# EAGLE design AudioAmplifier (EAGLE 8.3.2)
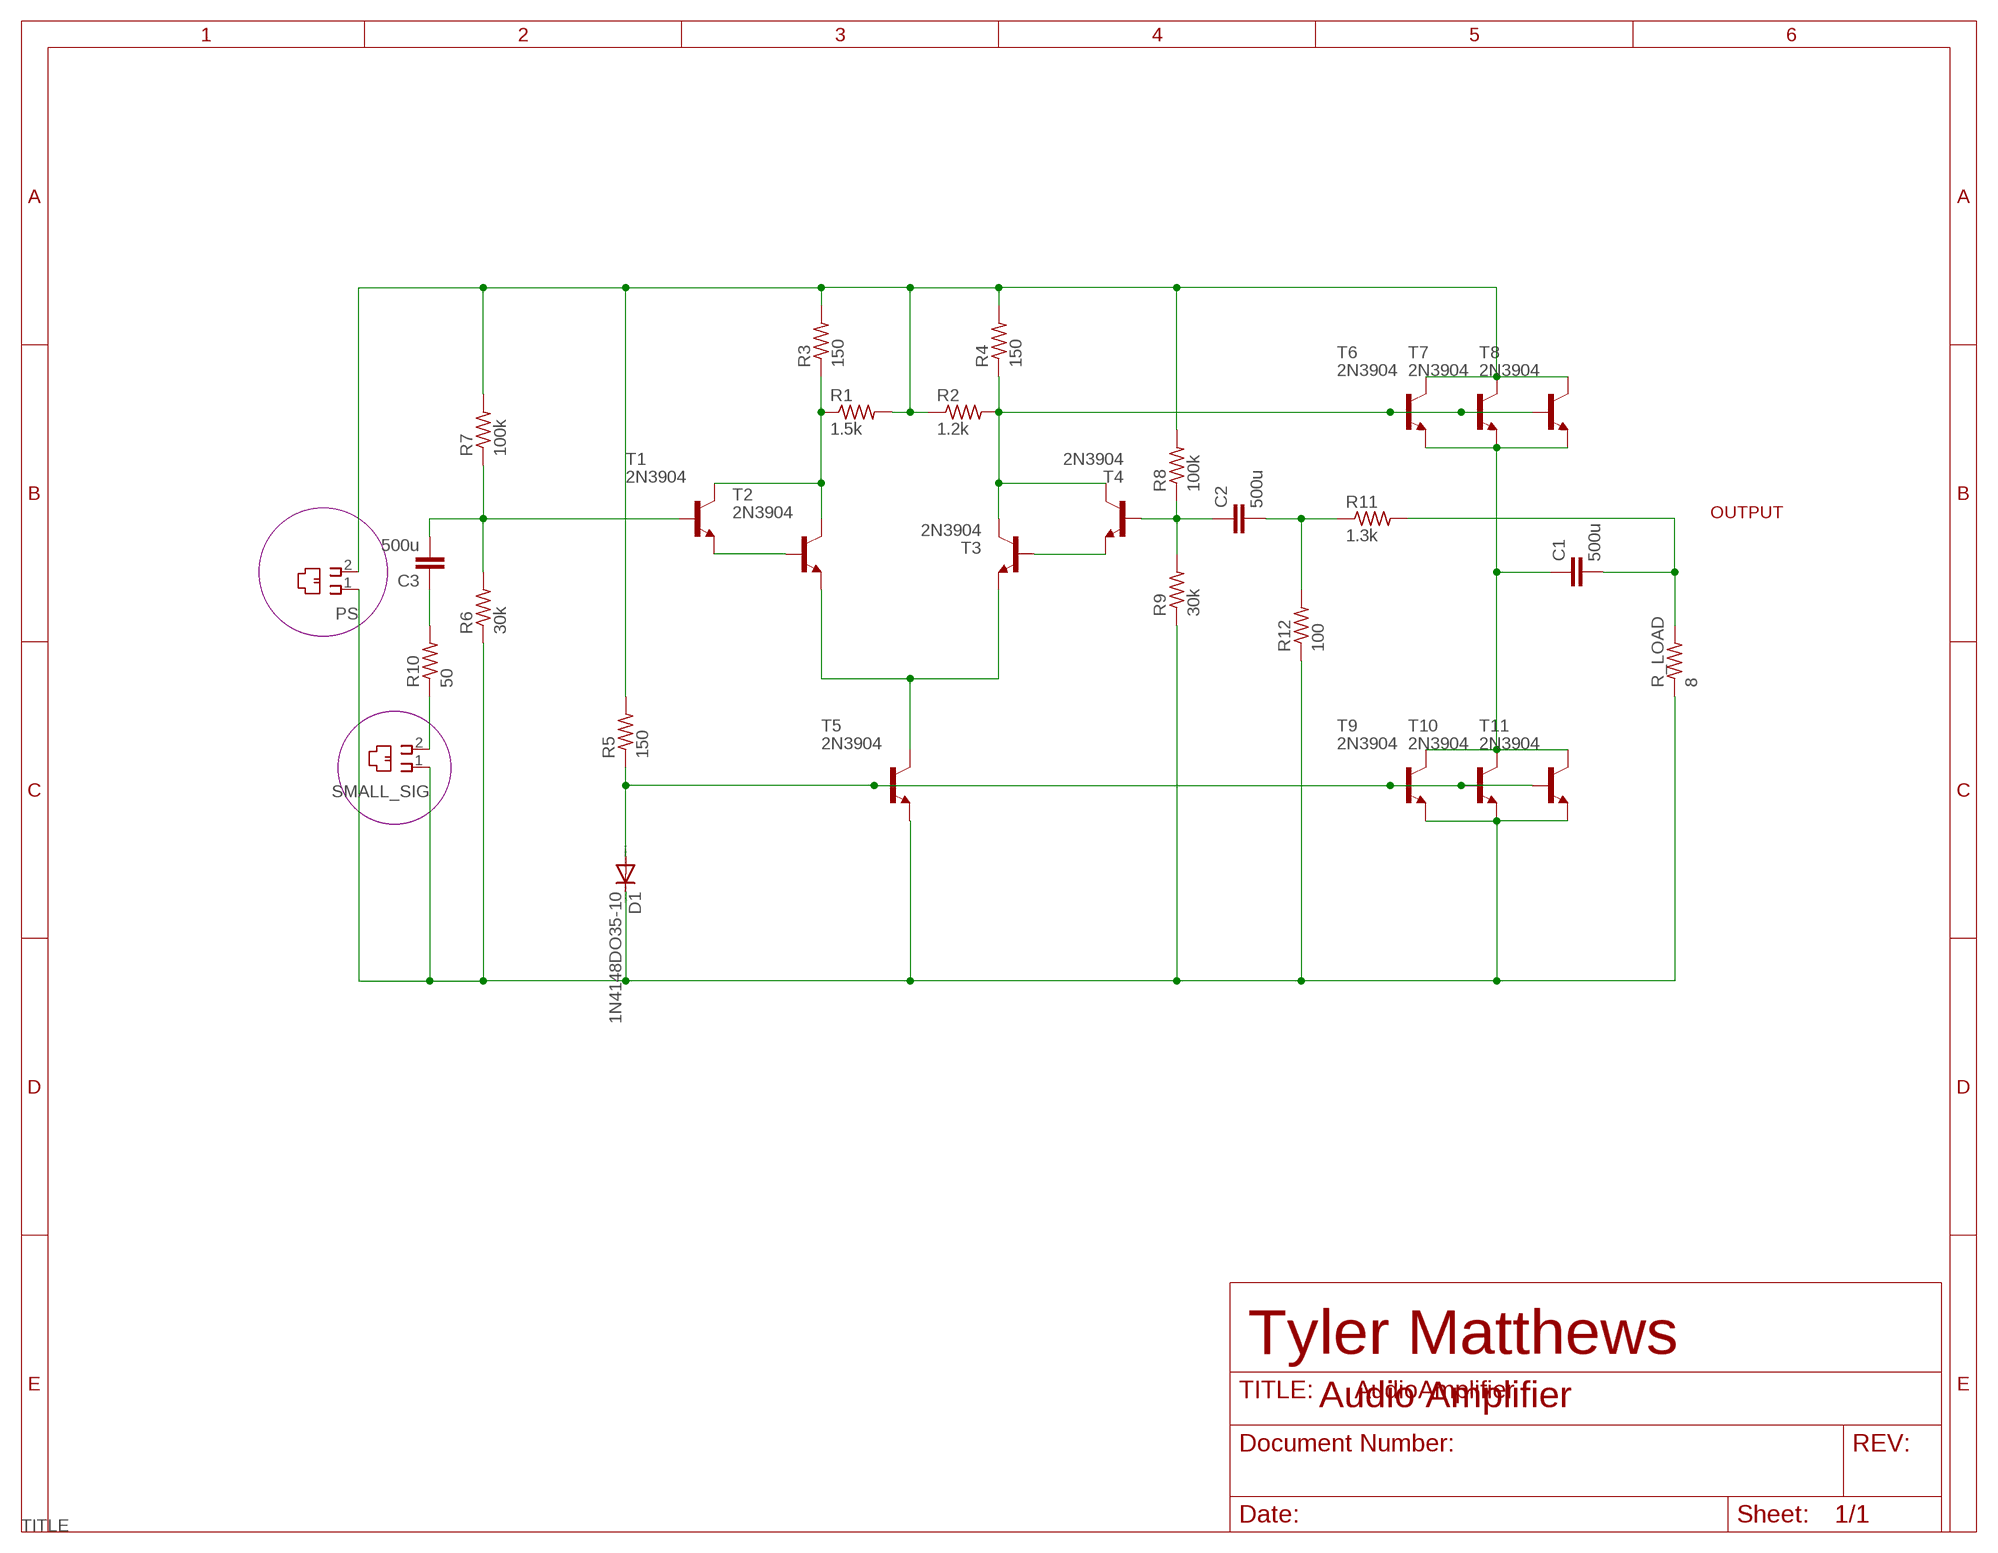
[diagram p0: schematic, sheet 1]
FRAME1 (FRAME_A_L): AUDIO_AMPLIFIER: TITLE

## Parts
C1  500u  C2.5/2  [C2.5-2]
C2  500u  C2.5/2  [C2.5-2]
C3  500u  C2.5/2  [C2.5-2]
D1  1N4148DO35-10  [DO35-10]
PS  215876-7  [215876-7]
R1  1.5k  R-US_0204/2V  [0204V]
R2  1.2k  R-US_0204/2V  [0204V]
R3  150  R-US_0204/2V  [0204V]
R4  150  R-US_0204/2V  [0204V]
R5  150  R-US_0204/2V  [0204V]
R6  30k  R-US_0204/2V  [0204V]
R7  100k  R-US_0204/2V  [0204V]
R8  100k  R-US_0204/2V  [0204V]
R9  30k  R-US_0204/2V  [0204V]
R10  50  R-US_0204/2V  [0204V]
R11  1.3k  R-US_0204/2V  [0204V]
R12  100  R-US_0204/2V  [0204V]
R_LOAD  8  R-US_0204/2V  [0204V]
SMALL_SIG  215876-7  [215876-7]
T1  2N3904  [TO92]
T2  2N3904  [TO92]
T3  2N3904  [TO92]
T4  2N3904  [TO92]
T5  2N3904  [TO92]
T6  2N3904  [TO92]
T7  2N3904  [TO92]
T8  2N3904  [TO92]
T9  2N3904  [TO92]
T10  2N3904  [TO92]
T11  2N3904  [TO92]

## Nets
N$1: T3.2(B) T4.3(E)
N$2: T1.3(E) T2.2(B)
N$3: R1.1 R3.1 T1.1(C) T2.1(C)
N$4: R2.2 R4.1 T3.1(C) T4.1(C) T6.2(B) T7.2(B) T8.2(B)
N$6: T2.3(E) T3.3(E) T5.1(C)
N$7: D1.A R5.1 T5.2(B) T9.2(B) T10.2(B) T11.2(B)
N$8: C3.2 R6.2 R7.1 T1.2(B)
N$9: C1.1 T6.3(E) T7.3(E) T8.3(E) T9.1(C) T10.1(C) T11.1(C)
N$10: R10.1 SMALL_SIG.2
N$11: C2.1 R8.1 R9.2 T4.2(B)
N$12: C3.1 R10.2
N$13: PS.2 R1.2 R2.1 R3.2 R4.2 R5.2 R7.2 R8.2 T6.1(C) T7.1(C) T8.1(C)
N$16: C2.2 R11.1 R12.2
N$17: D1.C PS.1 R6.1 R9.1 R12.1 R_LOAD.1 SMALL_SIG.1 T5.3(E) T9.3(E) T10.3(E) T11.3(E)
OUTPUT: C1.2 R11.2 R_LOAD.2

## Notes on the sheet
- Tyler Matthews
- Audio Amplifier

## Library data of the parts
C1-C3 = capacitor-wima:C: CAPACITOR naming: grid - package width
D1 = diode:1N4148: DIODE high speed (Philips)
PS SMALL_SIG = con-amp:215876-7: AMP connector
R1-R12 R_LOAD = rcl:R-US_: RESISTOR, American symbol
T1-T11 = transistor:2N3904: NPN TRANSISTOR

## Board
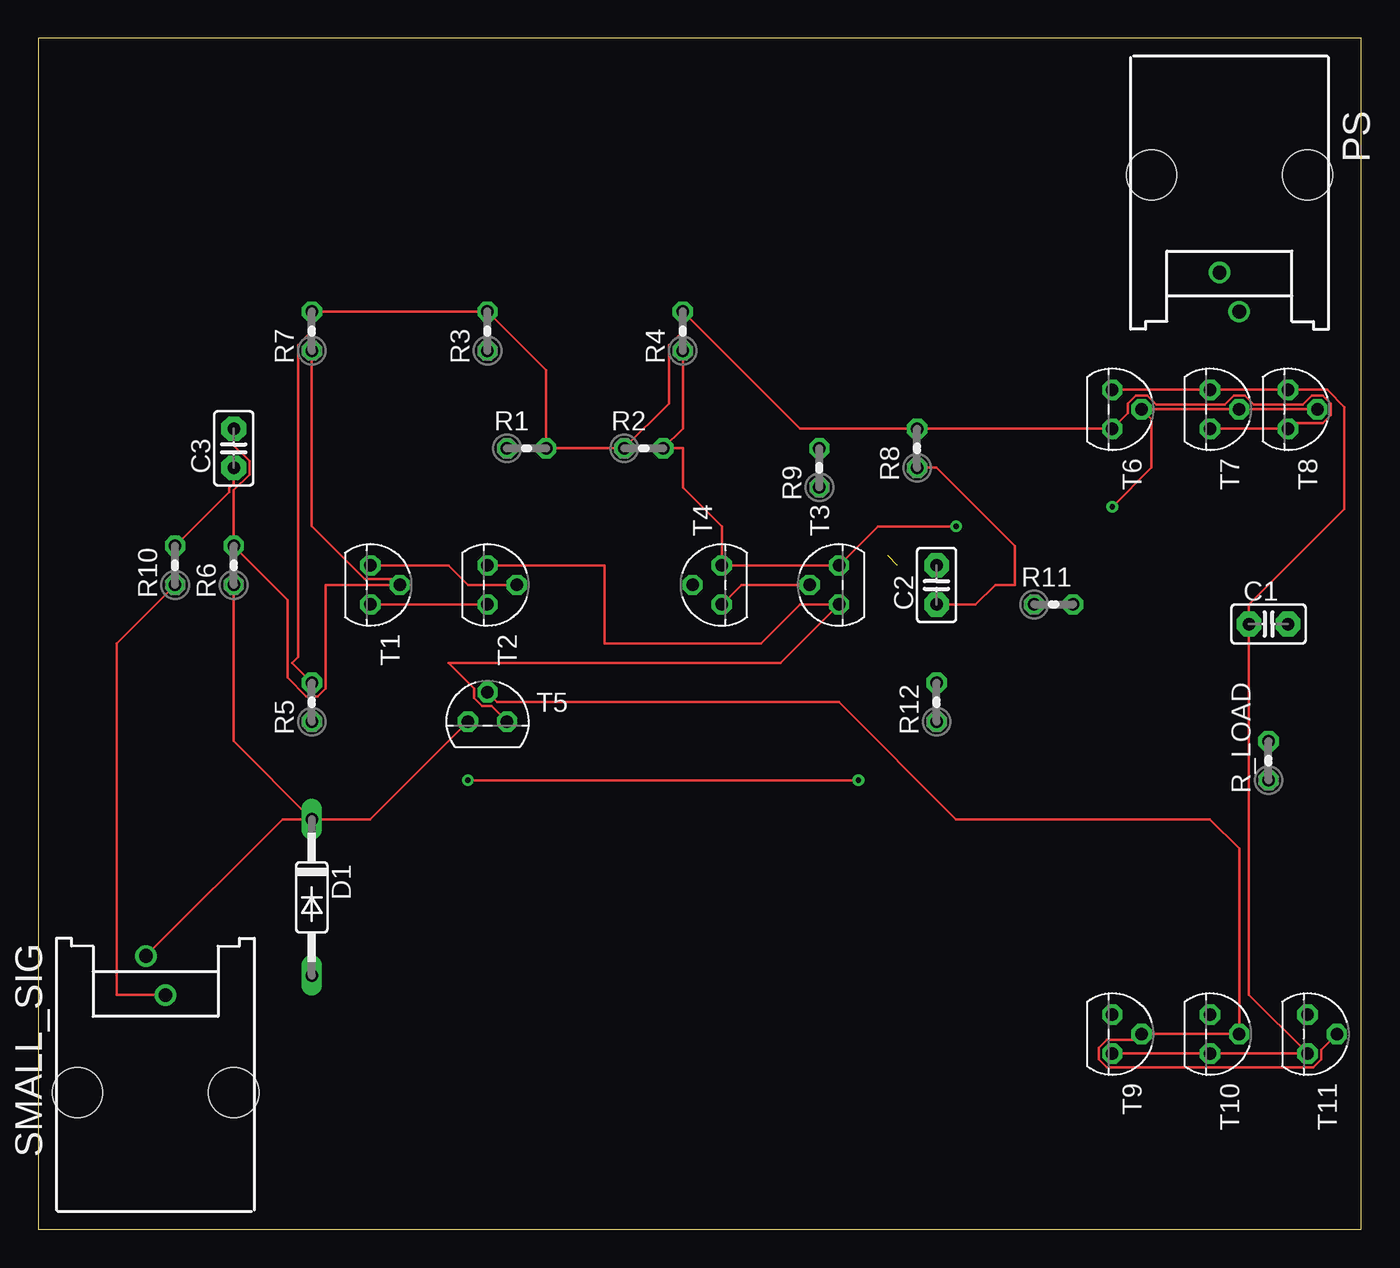
[diagram p1: board, top side]
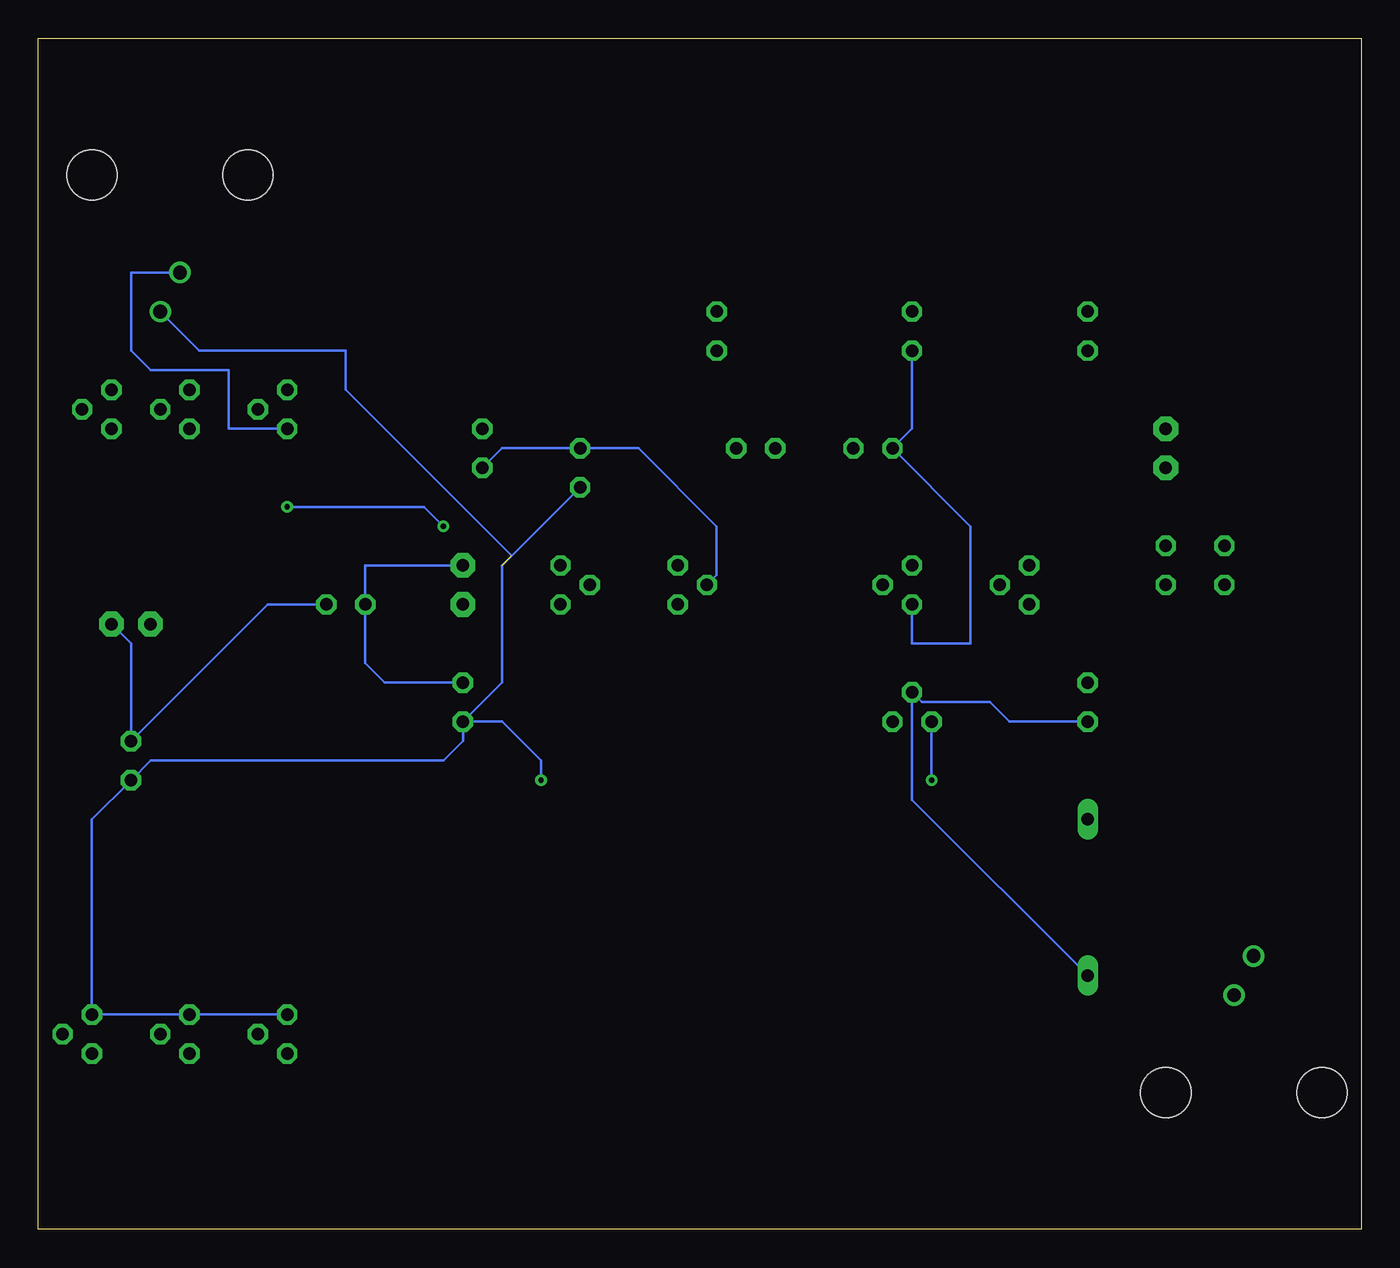
[diagram p2: board, bottom side, seen from below]

Size 86.03 x 77.46 mm. Coordinates in mm from the lower left corner, seen from the top.
Outline: 0,0 86.03,0 86.03,77.46 0,77.46 0,0
Copper layers (1*16): Top 0.035mm / dielectric 1.5mm / Bottom 0.035mm
Design rules "default": minimum track width 6mil, minimum drill 0.35mm, track to track 6mil, track to pad 6mil, pad to pad 6mil, via to via 6mil, smd to smd 6mil, copper to edge 40mil, drill to drill 6mil, minimum pad ring 10mil, minimum via ring 8mil, stop-mask expansion 4mil, vias tented up to drill 0mil, thermal gap 10mil

### Footprints (pad centres in the part's own frame; a part is rotated, then mirrored left to right if it is on the bottom)
C2.5-2 = drill 0.813 pad 1.6 octagon: 1 -1.27,0; 2 1.27,0
DO35-10 = drill 0.813 long: A 5.08,0; C -5.08,0
215876-7 = drill 0.889: 1 -0.635,8.89; 2 0.635,6.35 | hole 3.251: -5.08,0; 5.08,0
0204V = drill 0.813 octagon: 1 -1.27,0; 2 1.27,0
TO92 = drill 0.813 octagon: 1 1.27,0; 2 0,1.905; 3 -1.27,0

### Placement (x,y rotation side)
C1  80.01,39.37 0 top
C2  58.42,41.91 90 top
C3  12.7,50.8 90 top
D1  17.78,21.59 270 top
PS  77.47,68.58 180 top
R1  31.75,50.8 0 top
R2  39.37,50.8 0 top
R3  29.21,58.42 90 top
R4  41.91,58.42 90 top
R5  17.78,34.29 90 top
R6  12.7,43.18 90 top
R7  17.78,58.42 90 top
R8  57.15,50.8 90 top
R9  50.8,49.53 90 top
R10  8.89,43.18 90 top
R11  66.04,40.64 0 top
R12  58.42,34.29 90 top
R_LOAD  80.01,30.48 90 top
SMALL_SIG  7.62,8.89 0 top
T1  21.59,41.91 270 top
T2  29.21,41.91 270 top
T3  52.07,41.91 90 top
T4  44.45,41.91 90 top
T5  29.21,33.02 0 top
T6  69.85,53.34 270 top
T7  76.2,53.34 270 top
T8  81.28,53.34 270 top
T9  69.85,12.7 270 top
T10  76.2,12.7 270 top
T11  82.55,12.7 270 top

### Tracks (layer width: path | path; a pad name or v marks a point on that pad's centre or on a via)
N$1
  Top 0.152: T3.2 45.72,41.91 T4.3
N$2
  Top 0.152: T1.3 26.67,43.18 27.94,41.91 T2.2
N$3
  Top 0.152: T1.1 T2.1
  Bottom 0.152: R3.1 29.21,52.07 R1.1 25.4,45.72 25.4,38.1 29.21,38.1 T2.1
N$4  (via drill 0.35)
  Top 0.152: v69.85,46.99 72.39,49.53 72.39,52.7 T6.2 T7.2 T8.2 | R4.1 41.91,52.07 R2.2 41.91,50.8 41.91,48.26 44.45,45.72 T4.1 T3.1 54.61,45.72 v59.69,45.72
  Bottom 0.152: v59.69,45.72 60.96,46.99 v69.85,46.99
N$6
  Top 0.152: T5.1 29.46,34.04 28.84,34.04 28.32,34.56 28.32,35.18 26.67,36.83 48.26,36.83 T3.3 49.53,40.64 46.99,38.1 36.83,38.1 36.83,43.18 T2.3
N$7
  Top 0.152: T11.2 83.44,11.68 83.44,11.06 82.92,10.54 69.48,10.54 68.96,11.06 68.96,11.8 69.48,12.32 71.37,12.32 T9.2 T10.2 78.11,24.77 76.2,26.67 59.69,26.67 52.07,34.29 29.85,34.29 T5.2
  Bottom 0.152: R5.1 22.86,33.02 24.13,34.29 28.57,34.29 T5.2 29.21,27.94 D1.A
N$8
  Top 0.152: 24.13,41.91 23.75,42.29 21.22,42.29 17.78,45.73 R7.1 | 24.13,41.91 18.67,41.91 18.67,35.19 18.15,34.67 17.41,34.67 16.21,35.88 16.21,40.95 R6.2 12.7,48.08 13.73,49.1 13.73,49.96 12.7,50.98 C3.2 | T1.2 24.13,41.91
N$9
  Top 0.152: T6.3 T7.3 T8.3 83.82,54.61 84.94,53.49 84.94,46.84 78.74,40.64 C1.1 78.74,15.24 T11.1 T10.1 T9.1
N$10
  Top 0.152: SMALL_SIG.2 5.08,15.24 5.08,38.1 R10.1
N$11
  Top 0.152: R8.1 58.42,49.53 63.5,44.45 63.5,41.91 62.23,41.91 60.96,40.64 C2.1
  Bottom 0.152: R8.1 55.88,50.8 R9.2 46.99,50.8 41.91,45.72 41.91,42.55 T4.2
N$12
  Top 0.152: C3.1 12.7,48.51 12.39,48.2 12.39,47.95 R10.2
N$13
  Top 0.152: T7.1 T8.1 81.66,52.45 83.55,52.45 84.07,52.97 84.07,53.71 83.55,54.23 82.82,54.23 82.23,53.65 79.06,53.65 78.47,54.23 77.74,54.23 77.15,53.65 72.71,53.65 72.12,54.23 71.39,54.23 70.87,53.71 70.87,53.09 T6.1 R8.2 49.53,52.07 R4.2 41.91,58.41 41.02,57.52 41.02,53.72 R2.1 R1.2 33.02,55.88 R3.2 R7.2 17.78,58.41 16.89,57.52 16.89,37.21 16.51,36.83 R5.2
  Bottom 0.152: PS.2 80.01,62.23 80.01,57.15 78.74,55.88 73.66,55.88 73.66,52.07 T6.1
N$16
  Bottom 0.152: C2.2 64.77,43.18 R11.1 64.77,36.83 63.5,35.56 R12.2
N$17  (via drill 0.35)  (1 unrouted)
  Top 0.152: R6.1 12.7,31.75 D1.C | D1.C 15.87,26.67 SMALL_SIG.1 | D1.C 21.59,26.67 T5.3 | v27.94,29.21 v53.34,29.21
  Bottom 0.152: T9.3 T10.3 T11.3 82.55,26.67 R_LOAD.1 78.74,30.48 59.69,30.48 58.42,31.75 R12.1 | R12.1 55.88,35.56 55.88,43.18 R9.1 | 55.24,43.81 66.04,54.61 66.04,57.15 75.56,57.15 PS.1 | T5.3 v27.94,29.21 | v53.34,29.21 53.34,30.48 55.88,33.02 R12.1
OUTPUT
  Bottom 0.152: R11.2 71.12,40.64 R_LOAD.2 80.01,38.1 C1.2